# EAGLE design RGBWW-001 (EAGLE 7.6.0)
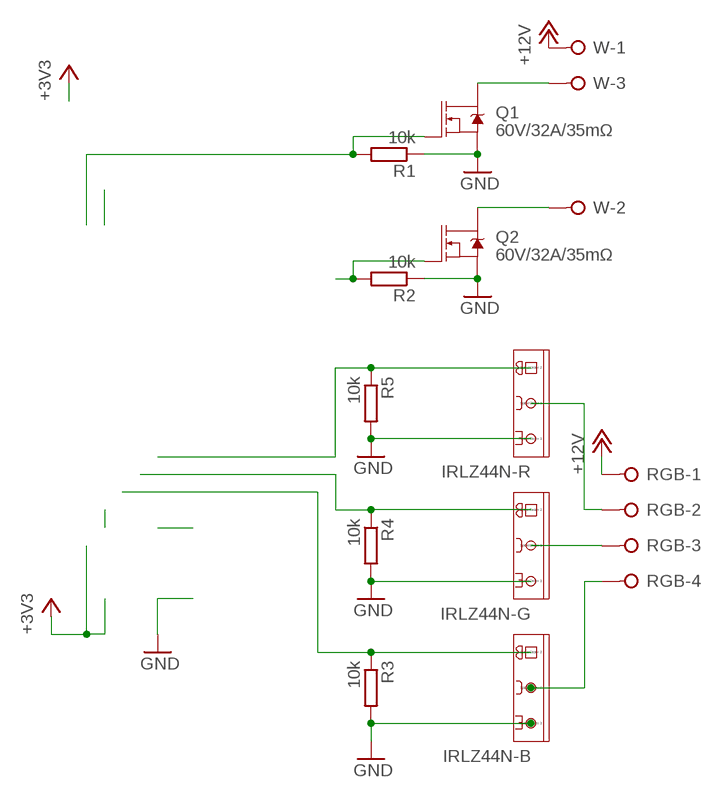
[diagram p0: schematic, sheet 1]

## Parts
IRLZ44N-B  TIP121  [TO220AV]
IRLZ44N-G  TIP121  [TO220AV]
IRLZ44N-R  TIP121  [TO220AV]
Q1  60V/32A/35mΩ  MOSFET-NCH-FQP30N06L  [TO220V]
Q2  60V/32A/35mΩ  MOSFET-NCH-FQP30N06L  [TO220V]
R1  10k  R-EU_R0805  [R0805]
R2  10k  R-EU_R0805  [R0805]
R3  10k  R-EU_R0805  [R0805]
R4  10k  R-EU_R0805  [R0805]
R5  10k  R-EU_R0805  [R0805]
RGB  W237-04P  [W237-4P]
W  W237-03P  [W237-133]

## Nets
+12V: RGB.1 W.1
GND: IRLZ44N-B.E IRLZ44N-G.E IRLZ44N-R.E Q1.3(S) Q2.3(S) R1.1 R2.1 R3.2 R4.2 R5.2
RGB-B: IRLZ44N-B.B R3.1
RGB-B-OUT: IRLZ44N-B.C RGB.4
RGB-G: IRLZ44N-G.B R4.1
RGB-G-OUT: IRLZ44N-G.C RGB.3
RGB-R: IRLZ44N-R.B R5.1
RGB-R-OUT: IRLZ44N-R.C RGB.2
RGB-WW [Signal]: Q1.1(G) R1.2
RGB-WW1 [Signal]: Q2.1(G) R2.2
RGB-WW-OUT: W.3
RGB-WW-OUT1: W.2
Unconnected: Q1.2(D) Q2.2(D)

## Library data of the parts
IRLZ44N-B IRLZ44N-G IRLZ44N-R = PAsystem:TIP121: TO-220
Q1 Q2 = SparkFun-DiscreteSemi:MOSFET-NCH: N-channel MOSFETs Voltage controlled devices that allow control of high current outputs. SparkFun Products: SparkFun OpenScale <https://www.sparkfun.com/products/13261> SparkFun Digital Sandbox <https://www.sparkfun.com/products/12651> SparkFun Monster Moto Shield <https://www.sparkfun.com/products/10182> SparkFun MOSFET Power Controller <https://www.sparkfun.com/products/11214>; PROD_ID: TRANS-10060
R1-R5 = rcl:R-EU_: RESISTOR, European symbol
RGB = con-wago-508:W237-04P: WAGO SREW CLAMP; OC_FARNELL: unknown; OC_NEWARK: unknown
W = con-wago-508:W237-03P: WAGO SREW CLAMP; OC_FARNELL: unknown; OC_NEWARK: unknown

## Net classes
1 12V: width 0.508 mm
2 GNDRGB: width 0.508 mm
3 3.3V: width 0.508 mm
4 GND3.3V: width 0.508 mm
5 Signal: width 0.381 mm

## Board
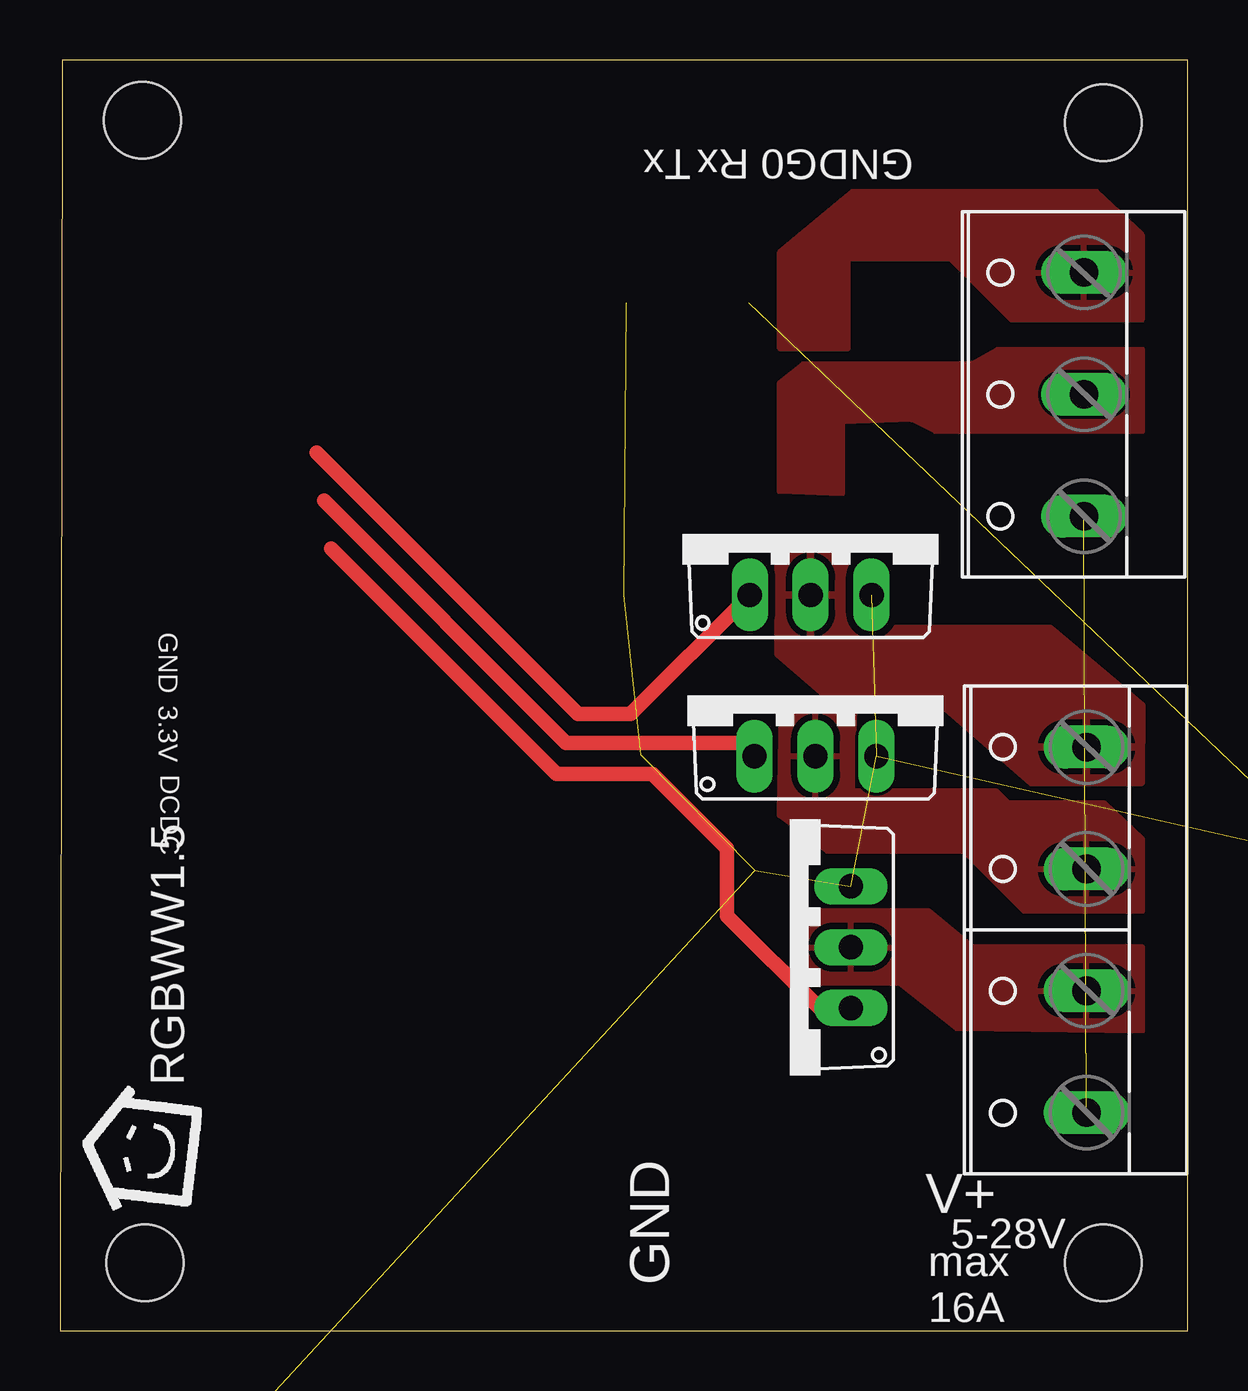
[diagram p1: board, top side]
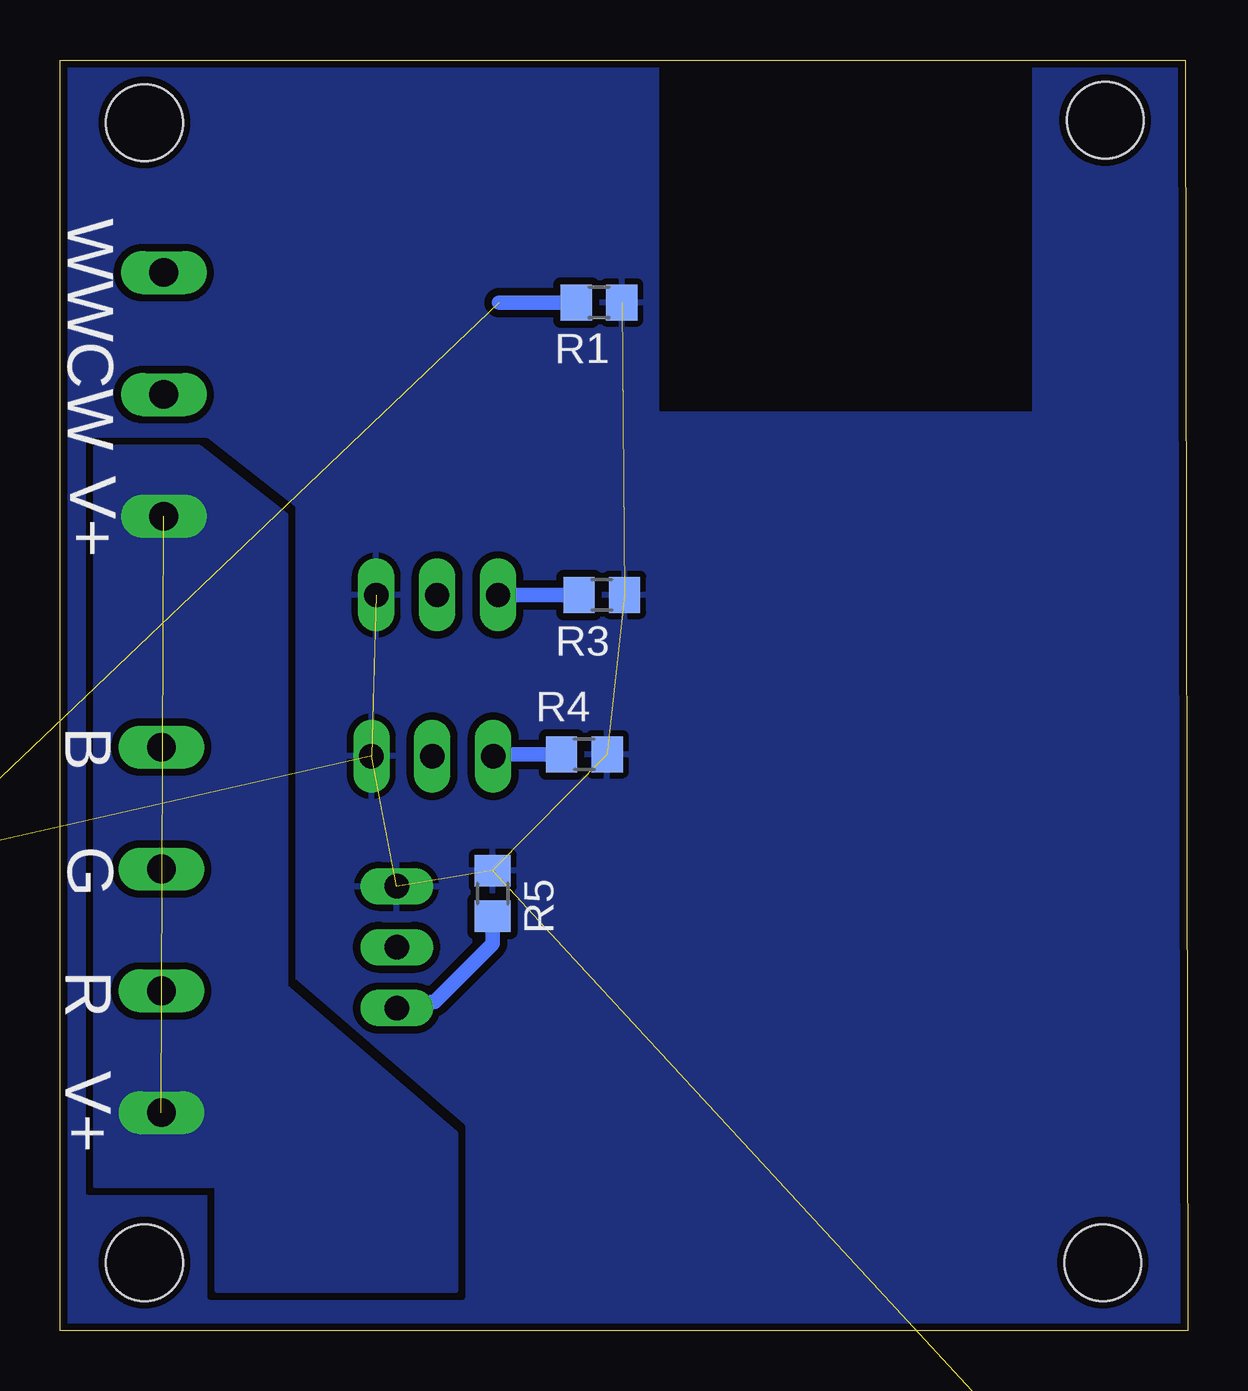
[diagram p2: board, bottom side, seen from below]

Size 47.01 x 52.97 mm. Coordinates in mm from the lower left corner, seen from the top.
Outline: 0,0 47.01,0 47.01,52.97 0.1,52.97 0,0
Copper layers (1*16): Top 0.035mm / dielectric 1.5mm / Bottom 0.035mm
Design rules "dirt_cheap_dirty_boards.v1": minimum track width 5mil, minimum drill 12mil, track to track 5mil, track to pad 5mil, pad to pad 5mil, via to via 5mil, smd to smd 0mil, copper to edge 10mil, drill to drill 10mil, minimum pad ring 10mil, minimum via ring 6mil, stop-mask expansion 2mil, vias tented up to drill 25mil, thermal gap 10mil
Holes 3.2 mm at 3.54,2.84 43.49,2.84 43.49,50.36 3.44,50.46

### Footprints (pad centres in the part's own frame; a part is rotated, then mirrored left to right if it is on the bottom)
TO220AV = drill 1.016 long: B -2.54,-2.54; C 0,-2.54; E 2.54,-2.54
TO220V = drill 1.016 long: 1 -2.54,0; 2 0,0; 3 2.54,0
R0805 = smd 1.3 x 1.5: 1 -0.95,0; 2 0.95,0
W237-4P = drill 1.194 long: 1 -7.62,-0.635; 2 -2.54,-0.635; 3 2.54,-0.635; 4 7.62,-0.635
W237-133 = drill 1.194 long: 1 -5.08,-0.635; 2 0,-0.635; 3 5.08,-0.635

### Placement (x,y rotation side)
IRLZ44N-B  31.29,33.21 0 top
IRLZ44N-G  31.49,26.49 0 top
IRLZ44N-R  30.43,15.99 90 top
Q1  60.1,15.5 90 top  (outside the outline)
Q2  0.1,-9.4 0 top  (outside the outline)
R1  24.54,42.86 180 bottom
R2  -4.1,-15.7 0 top  (outside the outline)
R3  24.43,30.67 0 bottom
R4  25.15,24.03 0 bottom
R5  28.97,18.23 90 bottom
RGB  42.15,16.71 90 top
U$1  [LOGO]  6.04,5.04 90 top
W  42.05,39.03 90 top

### Tracks (layer width: path | path; a pad name or v marks a point on that pad's centre or on a via)
+12V  (1 unrouted)
  pour Bottom (isolate 0.305, no thermals): 40.45,1.7 30.53,1.7 30.53,8.22 37.6,14.32 37.6,33.98 41.18,36.79 45.53,36.79 45.53,6.08 40.45,6.08
GND  (9 unrouted)
  pour Bottom (isolate 0.305, rank 6): 0,53 -0.1,0 47.03,0.2 47.13,53.2 22.16,52.9 22.16,38.2 6.35,38.2 6.35,52.9
RGB-B
  Top 0.61: 10.7,36.6 21.6,25.7 23.78,25.7 IRLZ44N-B.B
  Bottom 0.61: R3.1 IRLZ44N-B.B
RGB-B-OUT
  pour Top (isolate 0.305, rank 6): 45.09,26.06 45.08,22.86 40.5,22.84 36.3,26.5 31.9,26.5 29.92,28.2 29.92,32.68 32.69,32.65 32.77,30.15 33.55,29.27 41.29,29.27
RGB-CW-OUT
  pour Top: 32.6,34.9 30,35 30,39.5 31,40.3 38,40.3 39.1,40.9 45.1,40.9 45.1,37.5 36.5,37.5 35.5,38 32.6,37.9
RGB-G
  Top 0.61: 11,34.6 21.1,24.5 28.4,24.5 IRLZ44N-G.B
  Bottom 0.61: R4.1 28.87,24.03 IRLZ44N-G.B
RGB-G-OUT
  pour Top: 30.1,25.9 33.1,25.9 33,22.5 39,22.5 39.5,22 43.5,22 45.1,20.5 45.1,17.5 40.2,17.5 37.7,20 32,20 30,21.5
RGB-R
  Top 0.61: IRLZ44N-R.B 31.65,13.45 27.8,17.3 27.8,20.1 24.7,23.2 20.7,23.2 11.3,32.6
  Bottom 0.61: R5.1 28.97,16.13 31.4,13.7 31.55,13.7 31.8,13.45 IRLZ44N-R.B
RGB-R-OUT
  pour Top: 31,14.5 31,17.5 36.2,17.5 38,16 45.1,16 45.1,12.5 37.4,12.6 35,14.5
RGB-WW  (1 unrouted)
  Bottom 0.61: R1.2 28.7,42.86
RGB-WW1  (1 unrouted)
RGB-WW-OUT
  pour Top (isolate 0.305, rank 6): 45.09,42.14 39.68,42.14 37.14,44.68 32.83,44.68 32.83,40.94 30.02,40.94 30.02,44.95 33.06,47.49 43.18,47.49 45.09,45.68

### Text on the board
tNames: Tx | Rx | G0 | GND | GND | 3.3V | DCDC | RGBWW1.5 | V+ | GND | 5-28V | max / 16A
bNames: WW | CW | V+ | B | G | R | V+